# EAGLE design main (EAGLE 6.6.0)
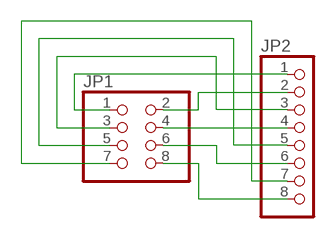
[diagram p0: schematic, sheet 1]

## Parts
JP1  PINHD-2X4  [2X04]
JP2  PINHD-1X8  [1X08]

## Nets
N$1: JP1.7 JP2.7
N$2: JP1.2 JP2.2
N$3: JP1.5 JP2.5
N$4: JP1.4 JP2.4
N$5: JP1.6 JP2.6
N$6: JP1.8 JP2.8
N$7: JP1.3 JP2.3
N$8: JP1.1 JP2.1

## Library data of the parts
JP1 = pinhead:PINHD-2X4: PIN HEADER
JP2 = pinhead:PINHD-1X8: PIN HEADER

## Board
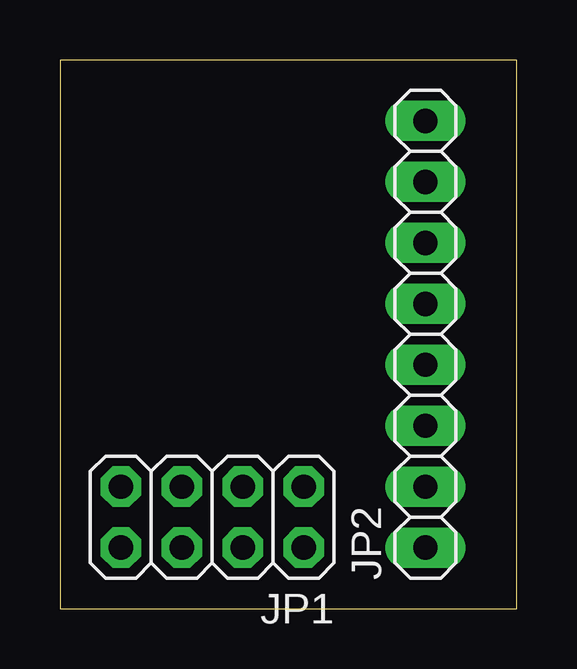
[diagram p1: board, top side]
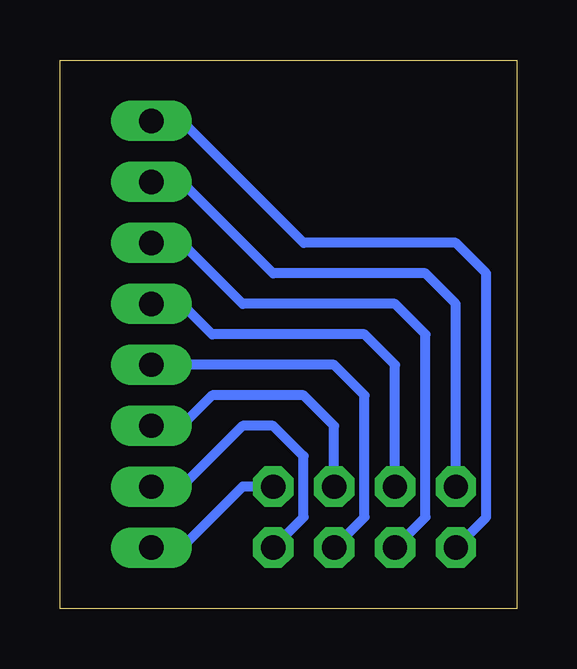
[diagram p2: board, bottom side, seen from below]

Size 19.05 x 22.86 mm. Coordinates in mm from the lower left corner, seen from the top.
Outline: 0,0 19.05,0 19.05,22.86 0,22.86 0,0
Copper layers (1*16): Top 0.035mm / dielectric 1.5mm / Bottom 0.035mm
Design rules "default *": minimum track width 10mil, minimum drill 24mil, track to track 8mil, track to pad 8mil, pad to pad 8mil, via to via 8mil, smd to smd 8mil, copper to edge 40mil, drill to drill 8mil, minimum pad ring 10mil, minimum via ring 8mil, stop-mask expansion 4mil, vias tented up to drill 0mil, thermal gap 10mil

### Footprints (pad centres in the part's own frame; a part is rotated, then mirrored left to right if it is on the bottom)
2X04 = drill 1.016 octagon: 1 -3.81,-1.27; 2 -3.81,1.27; 3 -1.27,-1.27; 4 -1.27,1.27; 5 1.27,-1.27; 6 1.27,1.27; 7 3.81,-1.27; 8 3.81,1.27
1X08 = drill 1.016 long: 1 -8.89,0; 2 -6.35,0; 3 -3.81,0; 4 -1.27,0; 5 1.27,0; 6 3.81,0; 7 6.35,0; 8 8.89,0

### Placement (x,y rotation side)
JP1  6.35,3.81 180 top
JP2  15.24,11.43 90 top

### Tracks (layer width: path | path; a pad name or v marks a point on that pad's centre or on a via)
N$1
  Bottom 0.406: JP1.7 2.54,12.7 3.81,13.97 10.16,13.97 13.97,17.78 JP2.7
N$2
  Bottom 0.406: JP1.2 8.89,3.81 8.89,6.35 10.16,7.62 11.43,7.62 13.97,5.08 JP2.2
N$3
  Bottom 0.406: JP1.5 5.08,10.16 6.35,11.43 12.7,11.43 13.97,12.7 JP2.5
N$4
  Bottom 0.406: JP1.4 6.35,3.81 6.35,8.89 7.62,10.16 JP2.4
N$5
  Bottom 0.406: JP1.6 3.81,3.81 3.81,11.43 5.08,12.7 11.43,12.7 13.97,15.24 JP2.6
N$6
  Bottom 0.406: JP1.8 1.27,3.81 1.27,13.97 2.54,15.24 8.89,15.24 13.97,20.32 JP2.8
N$7
  Bottom 0.406: JP1.3 7.62,7.62 8.89,8.89 12.7,8.89 13.97,7.62 JP2.3
N$8
  Bottom 0.406: JP1.1 11.43,5.08 13.97,2.54 JP2.1